# EAGLE design USB_Zigbee_V1.0 (EAGLE 7.2.0)
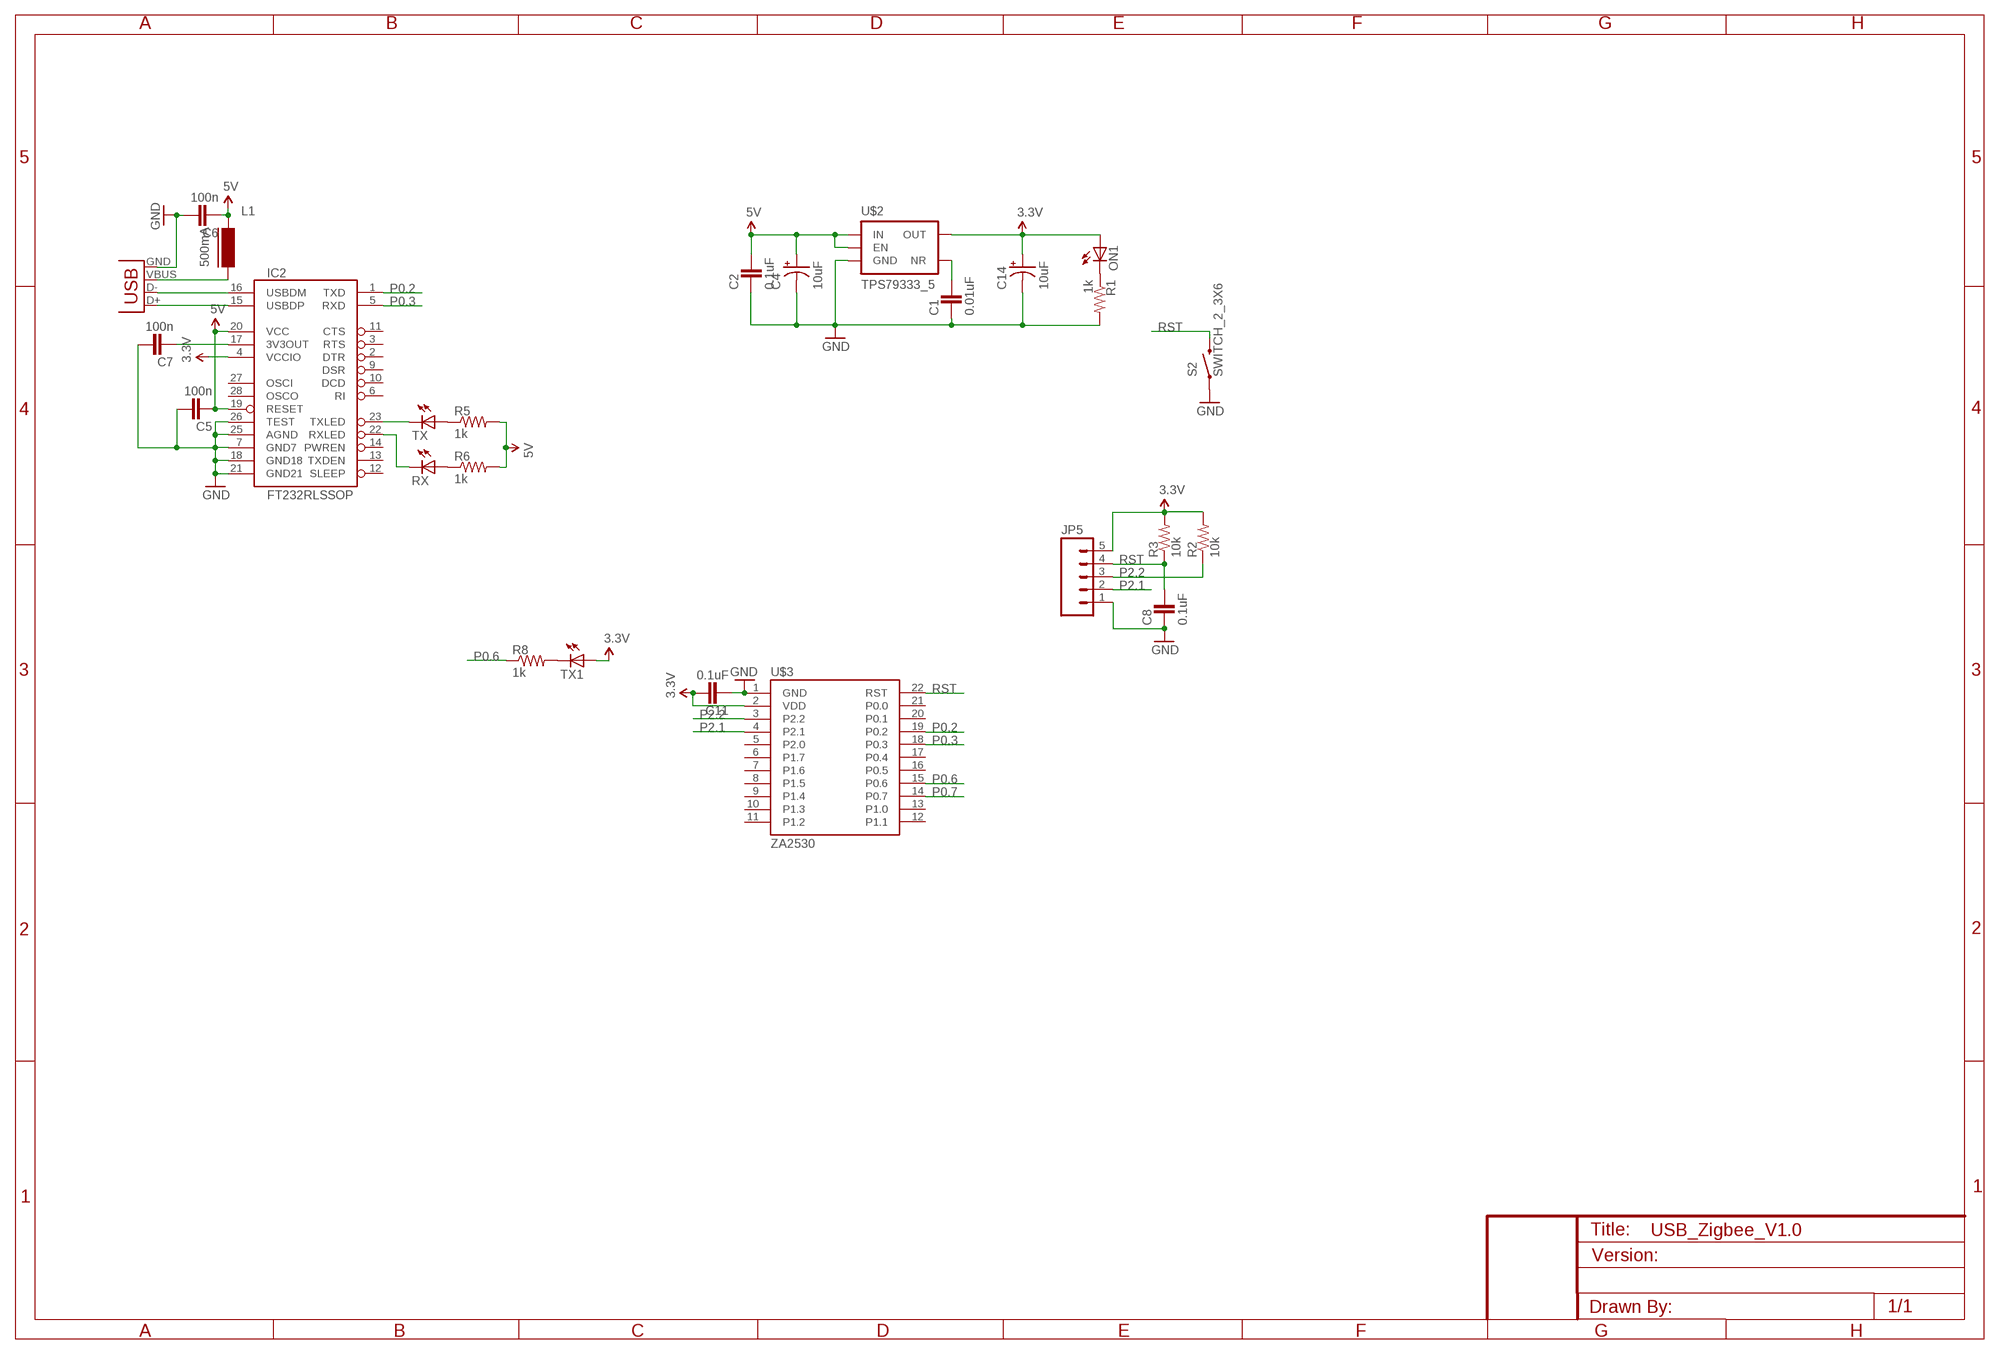
[diagram p0: schematic, sheet 1]

## Parts
C1  0.01uF  CAP0603  [0603-CAP]
C2  0.1uF  CAP0603  [0603-CAP]
C4  10uF  CAP_POL1206  [EIA3216]
C5  100n  CAP0603  [0603-CAP]
C6  100n  CAP0603  [0603-CAP]
C7  100n  CAP0603  [0603-CAP]
C8  0.1uF  CAP0603  [0603-CAP]
C11  0.1uF  CAP0603  [0603-CAP]
C14  10uF  CAP_POL1206  [EIA3216]
IC2  FT232RLSSOP  [SSOP28DB]
JP5  M05PTH  [1X05]
L1  500mA  FERRITE-0805  [FB805]
ON1  LED0603  [LED-0603]
R1  1k  RESISTOR0603-RES  [0603-RES]
R2  10k  RESISTOR0603-RES  [0603-RES]
R3  10k  RESISTOR0603-RES  [0603-RES]
R5  1k  RESISTOR0603-RES  [0603-RES]
R6  1k  RESISTOR0603-RES  [0603-RES]
R8  1k  RESISTOR0603-RES  [0603-RES]
RX  LED0603  [LED-0603]
S2  SWITCH_2_3X6  [TACTILE-SWITCH-1101NE]
TX  LED0603  [LED-0603]
TX1  LED0603  [LED-0603]
U$2  TPS79333_5  [SOT23-5]
U$3  ZA2530  [ZA2530]
X1  USB_4-A-H_2  [USB-A-H_2]

## Nets
3.3V: C11.1 C14.A(+) IC2.4(VCCIO) JP5.5 ON1.A R2.2 R3.2 TX1.A U$2.5(OUT) U$3.2(VDD)
5V [usbvcc]: C2.1 C4.A(+) C5.2 C6.2 IC2.19(RESET) IC2.20(VCC) L1.1 R5.2 R6.2 U$2.1(IN) U$2.3(EN)
GND [gnd]: C1.2 C2.2 C4.C(-) C5.1 C6.1 C7.1 C8.2 C11.2 C14.C(-) IC2.7(GND7) IC2.18(GND18) IC2.21(GND21) IC2.25(AGND) IC2.26(TEST) JP5.1 R1.2 S2.P$1 U$2.2(GND) U$3.1(GND) X1.GND
N$1: ON1.C R1.1
N$2: R5.1 TX.A
N$3: L1.2 X1.VBUS
N$4: R8.2 TX1.C
N$5: IC2.16(USBDM) X1.D-
N$6: IC2.15(USBDP) X1.D+
N$7: IC2.23(TXLED) TX.C
N$8: R6.1 RX.A
N$9: C1.1 U$2.4(NR)
N$10: IC2.22(RXLED) RX.C
N$22: C7.2 IC2.17(3V3OUT)
P0.2: IC2.1(TXD) U$3.19(P0.2)
P0.3: IC2.5(RXD) U$3.18(P0.3)
P0.6: R8.1 U$3.15(P0.6)
P0.7: U$3.14(P0.7)
P2.1: JP5.2 U$3.4(P2.1)
P2.2: JP5.3 R2.1 U$3.3(P2.2)
RST: C8.1 JP5.4 R3.1 S2.P$2 U$3.22(RST)
Unconnected: IC2.2(DTR) IC2.3(RTS) IC2.6(RI) IC2.9(DSR) IC2.10(DCD) IC2.11(CTS) IC2.12(SLEEP) IC2.13(TXDEN) IC2.14(PWREN) IC2.27(OSCI) IC2.28(OSCO) U$3.5(P2.0) U$3.6(P1.7) U$3.7(P1.6) U$3.8(P1.5) U$3.9(P1.4) U$3.10(P1.3) U$3.11(P1.2) U$3.12(P1.1) U$3.13(P1.0) U$3.16(P0.5) U$3.17(P0.4) U$3.20(P0.1) U$3.21(P0.0)

## Library data of the parts
C1 C2 C5-C8 C11 = 2SparkFun:CAP: Capacitor Standard 0603 ceramic capacitor, and 0.1" leaded capacitor.
C4 C14 = 2SparkFun:CAP_POL: Capacitor Polarized These are standard SMD and PTH capacitors. Normally 10uF, 47uF, and 100uF in electrolytic and tantalum varieties. Always verify the external diameter of the through hole cap, it varies with capacity, voltage, and manufacturer. The EIA devices should be standard.
IC2 = 1SparkFun:FT232RL: USB UART FT232RL 4th Generation USB UART (USB <-> Serial) Controller. Spark Fun Electronics SKU : COM-00650
JP5 = 2SparkFun:M05: Header 5 Standard 5-pin 0.1" header. Use with straight break away headers (SKU : PRT-00116), right angle break away headers (PRT-00553), swiss pins (PRT-00743), machine pins (PRT-00117), and female headers (PRT-00115). Molex polarized connector foot print use with SKU : PRT-08230 with associated crimp pins and housings.
L1 = 2SparkFun:FERRITE: Ferrite bead in various packages
ON1 RX TX TX1 = 1SparkFun:LED: LEDs Standard schematic elements and footprints for 5mm, 3mm, 1206, and 0603 sized LEDs. 5mm - Spark Fun Electronics SKU : COM-00529 (and others)
R1-R3 R5 R6 R8 = 2SparkFun:RESISTOR: Resistor Basic schematic elements and footprints for 0603, 1206, and PTH resistors.
S2 = 2SparkFun:SWITCH_2
U$2 = 2SparkFun:TPS79333_5
U$3 = 2SparkFun:ZA2530
X1 = 2SparkFun:USB_4: USB Connectors USB-B-PTH is fully proven SKU : PRT-00139 USB-miniB is fully proven SKU : PRT-00587 USB-A-PCB is untested. USB-A-H is throughly reviewed, but untested. Spark Fun Electronics SKU : PRT-00437 USB-B-SMT is throughly reviewed, but untested. Needs silkscreen touching up. USB-A-S has not been used/tested USB-MB-H has not been used/tested

## Net classes
0 default: width 0.254 mm, clearance 0.254 mm
1 power: width 0.61 mm, drill 0.61 mm, clearance 0.254 mm
2 gnd: width 0.305 mm, drill 0.381 mm, clearance 0.254 mm
3 usbvcc: width 0.508 mm, drill 0.61 mm, clearance 0.254 mm
4 aref: width 0.406 mm, drill 0.61 mm, clearance 0.254 mm

## Board
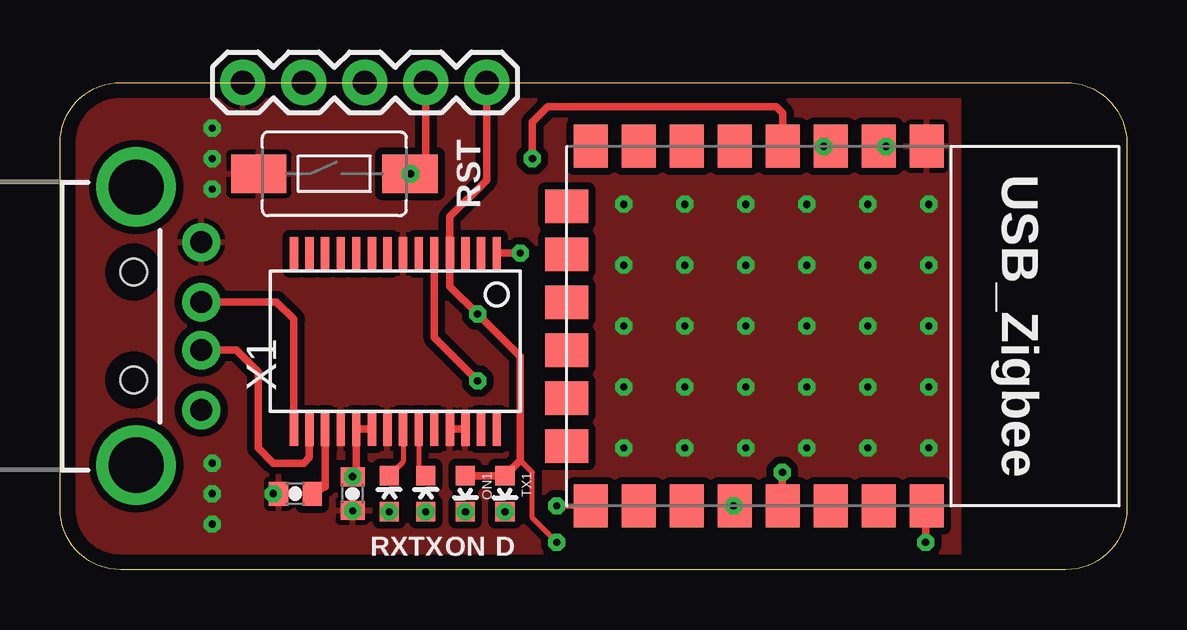
[diagram p1: board, top side]
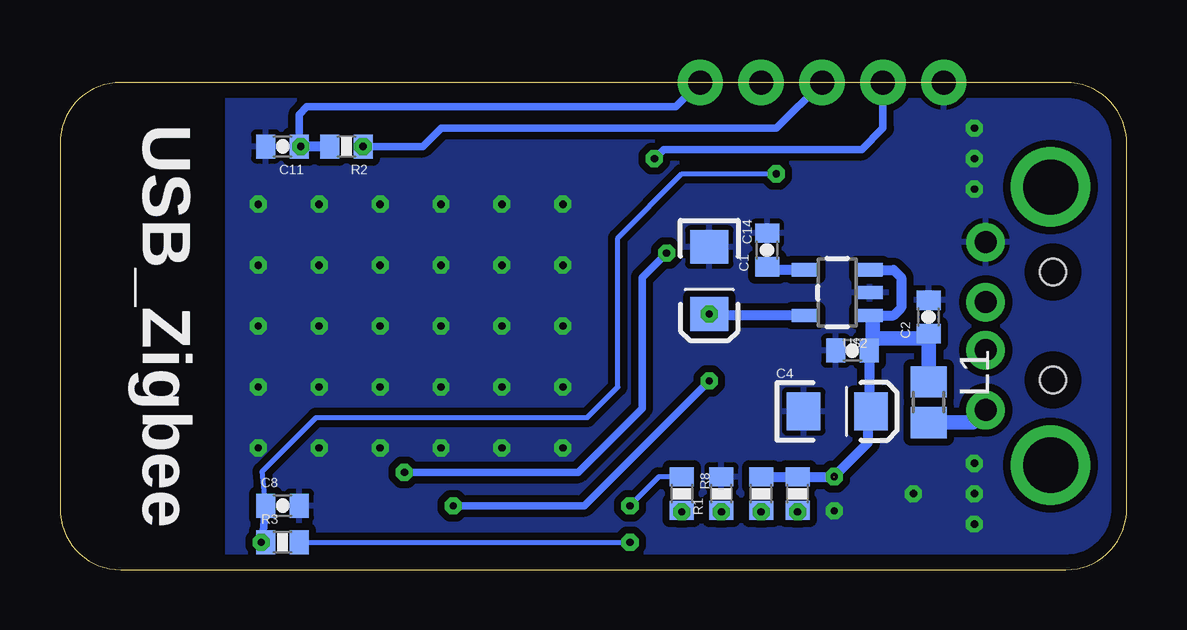
[diagram p2: board, bottom side, seen from below]

Size 44.45 x 20.32 mm. Coordinates in mm from the lower left corner, seen from the top.
Outline: 0,2.54 0,17.78 arc-90 2.54,20.32 41.91,20.32 arc-90 44.45,17.78 44.45,2.54 arc-90 41.91,0 2.54,0 arc-90 0,2.54
Copper layers (1*16): Top 0.035mm / dielectric 1.5mm / Bottom 0.035mm
Design rules "yun": minimum track width 8mil, minimum drill 15mil, track to track 8mil, track to pad 8mil, pad to pad 8mil, via to via 8mil, smd to smd 8mil, copper to edge 25mil, drill to drill 8mil, minimum pad ring 8mil, minimum via ring 8mil, stop-mask expansion 4mil, vias tented up to drill 20mil, thermal gap 8mil

### Footprints (pad centres in the part's own frame; a part is rotated, then mirrored left to right if it is on the bottom)
0603-CAP = smd 0.8 x 1: 1 -0.7,0; 2 0.7,0
EIA3216 = smd 1.4 x 1.6: A 1.4,0; C -1.4,0
SSOP28DB = smd 0.348 x 1.397: 1 -4.225,-3.656; 2 -3.575,-3.656; 3 -2.925,-3.656; 4 -2.275,-3.656; 5 -1.625,-3.656; 6 -0.975,-3.656; 7 -0.325,-3.656; 8 0.325,-3.656; 9 0.975,-3.656; 10 1.625,-3.656; 11 2.275,-3.656; 12 2.925,-3.656; 13 3.575,-3.656; 14 4.225,-3.656; 15 4.225,3.656; 16 3.575,3.656; 17 2.925,3.656; 18 2.275,3.656; 19 1.625,3.656; 20 0.975,3.656; 21 0.325,3.656; 22 -0.325,3.656; 23 -0.975,3.656; 24 -1.625,3.656; 25 -2.275,3.656; 26 -2.925,3.656; 27 -3.575,3.656; 28 -4.225,3.656
1X05 = drill 1 pad 1.88: 1 0,0; 2 2.54,0; 3 5.08,0; 4 7.62,0; 5 10.16,0
FB805 = smd 1.3 x 1.5: 1 -0.85,0; 2 0.85,0
LED-0603 = smd 0.8 x 0.8: A 0,-0.75; C 0,0.75
0603-RES = smd 0.8 x 1: 1 -0.7,0; 2 0.7,0
TACTILE-SWITCH-1101NE = smd 2.3 x 1.6: P$1 -3.15,0; P$2 3.15,0
SOT23-5 = smd 1.1 x 0.55: 1 -1.35,0.95; 2 -1.35,0; 3 -1.35,-0.95; 4 1.35,-0.95; 5 1.35,0.95
ZA2530 = smd 1.8 x 1.4: 1 -7.5,5; 2 -7.5,3; 3 -7.5,1; 4 -7.5,-1; 5 -7.5,-3; 6 -7.5,-5; 7 -7.5,-7; 8 -7.5,-9; 15 7.5,-9; 16 7.5,-7; 17 7.5,-5; 18 7.5,-3; 19 7.5,-1; 20 7.5,1; 21 7.5,3; 22 7.5,5 | smd 1.4 x 1.8: 9 -5,-10; 10 -3,-10; 11 -1,-10; 12 1,-10; 13 3,-10; 14 5,-10
USB-A-H_2 = drill 0.92 pad 1.6: D+ 2.71,1; D- 2.71,-1; VBUS 2.71,-3.5 | drill 0.914 pad 1.6: GND 2.71,3.5 | drill 2.3: GND2 0,-5.8; GND3 0,5.8 | hole 1.1: -0.1,2.25; -0.1,-2.25

### Placement (x,y rotation side)
C1  14.99,13.34 90 bottom
C2  8.26,10.54 90 bottom
C4  12.06,6.6 0 bottom
C5  12.19,3.17 90 top
C6  11.43,9.14 0 bottom
C7  9.8,3.17 0 top
C8  35.18,2.67 0 bottom
C11  35.18,17.65 180 bottom
C14  17.4,12.06 270 bottom
IC2  13.97,9.53 180 top
JP5  7.62,20.32 0 top
L1  8.26,6.99 270 bottom
ON1  16.89,3.17 180 top
R1  16.89,3.17 90 bottom
R2  32.51,17.65 180 bottom
R3  35.18,1.14 0 bottom
R5  15.24,3.17 90 bottom
R6  13.72,3.17 90 bottom
R8  18.54,3.17 270 bottom
RX  13.72,3.17 0 top
S2  11.43,16.51 0 top
TX  15.24,3.17 0 top
TX1  18.54,3.17 180 top
U$2  12.06,11.56 180 bottom
U$3  31.11,10.16 270 top
X1  3.17,10.16 0 top

### Tracks (layer width: path | path; a pad name or v marks a point on that pad's centre or on a via)
3.3V  (via drill 0.3)
  Top 0.203: v20.7,1.14 19.68,2.16 19.68,4.05 19.18,4.56
  Top 0.305: JP5.5 17.78,16.26 16.25,14.72 IC2.4 16.25,11.82 C14.A 19.18,8.89 19.18,4.56 TX1.A ON1.A | U$3.2 v34.41,17.66 v34.42,17.65
  Bottom 0.203: R3.2 v20.7,1.14
  Bottom 0.305: v34.42,17.65 C11.1 34.48,18.99 34.16,19.3 18.8,19.3 JP5.5
  Bottom 0.406: U$2.5 17.34,10.61 C14.A | R2.2 C11.1
  other vias: 17.4,10.67
5V  (via drill 0.3)  (1 unrouted)
  Top 0.305: IC2.20 IC2.19 12.35,4.04 v12.19,3.89
  Bottom 0.406: R5.2 R6.2 12.2,3.88 v12.19,3.89 | 12.23,4.03 v12.19,3.89 | 10.58,9.65 C6.2 10.73,6.67 | 10.58,10.47 U$2.1 9.71,10.61 9.4,10.92 9.4,12.19 9.71,12.51 U$2.3 | C2.1 8.29,9.65 | 10.73,6.67 C4.A | 10.73,6.67 10.73,6.42 10.79,6.35 10.79,5.28 v12.19,3.89
  Bottom 0.61: 10.58,10.47 10.58,9.65 8.29,9.65 | L1.1 C2.1
GND  (via drill 0.3)
  Top 0.305: IC2.25 IC2.26
  other vias: 12.19,2.46 8.89,3.17 26.04,12.7 23.5,15.24 28.57,15.24 28.57,10.16 26.04,7.62 23.5,5.08 28.57,5.08 31.11,7.62 31.11,12.7 33.66,10.16 33.66,15.24 33.66,5.08 36.2,7.62 23.5,12.7 26.04,15.24 26.04,10.16 23.5,7.62 26.04,5.08 28.57,7.62 28.57,12.7 31.11,15.24 31.11,10.16 31.11,5.08 33.66,7.62 33.66,12.7 36.2,15.24 36.2,10.16 36.2,5.08 23.5,10.16 36.2,12.7 6.35,18.41 6.35,17.14 6.35,15.88 6.35,1.91 6.35,3.17 6.35,4.45
  pour Bottom (isolate 0.305, rank 2): 0,0 37.47,0 37.47,20.32 0,20.32
  pour Top (isolate 0.305, rank 2): 0,0 37.47,0 37.47,20.32 0,20.32
N$1  (via drill 0.3)
  Top 0.203: v16.89,2.41 ON1.C
  Bottom 0.203: R1.1 v16.89,2.41
N$2  (via drill 0.3)
  Top 0.203: v15.24,2.41 TX.A
  Bottom 0.203: R5.1 v15.24,2.41
N$3
  Bottom 0.61: X1.VBUS 6.41,6.13 L1.2
N$4  (via drill 0.3)
  Top 0.203: v18.54,2.41 TX1.C
  Bottom 0.203: R8.2 v18.54,2.41
N$5
  Top 0.305: IC2.16 10.39,4.68 10.16,4.45 8.89,4.45 8.26,5.08 8.26,8.26 7.35,9.16 X1.D-
N$6
  Top 0.305: IC2.15 9.74,10.45 9.02,11.18 5.9,11.18 X1.D+
N$7
  Top 0.203: IC2.23 14.95,4.22 TX.C
N$8  (via drill 0.3)
  Top 0.203: v13.72,2.41 RX.A
  Bottom 0.203: R6.1 v13.72,2.41
N$9
  Bottom 0.406: U$2.4 14.96,12.51 C1.1
N$10
  Top 0.203: IC2.22 14.29,4.5 RX.C
N$22
  Top 0.305: IC2.17 11.04,3.46 C7.2
P0.2  (via drill 0.3)
  Top 0.305: U$3.19 30.1,2.68 v30.1,4.06 | v19.18,13.21 18.22,13.21 IC2.1
  Bottom 0.305: v30.1,4.06 22.86,4.06 20.19,6.73 20.19,12.19 v19.18,13.21
P0.3  (via drill 0.3)
  Top 0.305: U$3.18 28.11,2.59 v28.07,2.67 | v17.4,7.87 15.6,9.68 IC2.5
  Bottom 0.305: v28.07,2.67 22.61,2.67 v17.4,7.87
P0.6  (via drill 0.3)
  Top 0.203: v20.7,2.67 22.11,2.67 U$3.15
  Bottom 0.203: R8.1 19.49,3.88 v20.7,2.67
P2.1  (via drill 0.3)
  Top 0.305: U$3.4 30.11,19.03 29.84,19.3 20.32,19.3 19.68,18.67 v19.68,17.14
  Bottom 0.305: v19.68,17.14 19.3,17.53 11.05,17.53 10.16,18.41 JP5.2
P2.2  (via drill 0.3)
  Top 0.305: 32.26,17.65 32.27,17.66 U$3.3 31.88,17.66 v31.83,17.65 31.88,17.68 32.35,17.68
  Bottom 0.305: JP5.3 14.61,18.41 28.57,18.41 29.34,17.65 R2.1 31.94,17.59 v31.83,17.65
RST  (via drill 0.3)
  Top 0.203: v14.61,16.51 S2.P$2
  Top 0.305: v36.07,1.14 36.07,2.61 U$3.22 | JP5.4 15.24,17.14 v14.61,16.51
  Bottom 0.203: C8.1 36.03,4.1 33.78,6.35 22.48,6.35 21.21,7.62 21.21,13.84 18.54,16.51 v14.61,16.51
  Bottom 0.305: C8.1 36.03,1.18 v36.07,1.14 R3.1

### Text on the board
tPlace: RST | USB_Zigbee | RX | TX | ON | D
bPlace: USB_Zigbee